# Altium schematic sheet CAN.SchDoc
size 420 x 297 mm; SheetNumber: 3; SheetTotal: 3
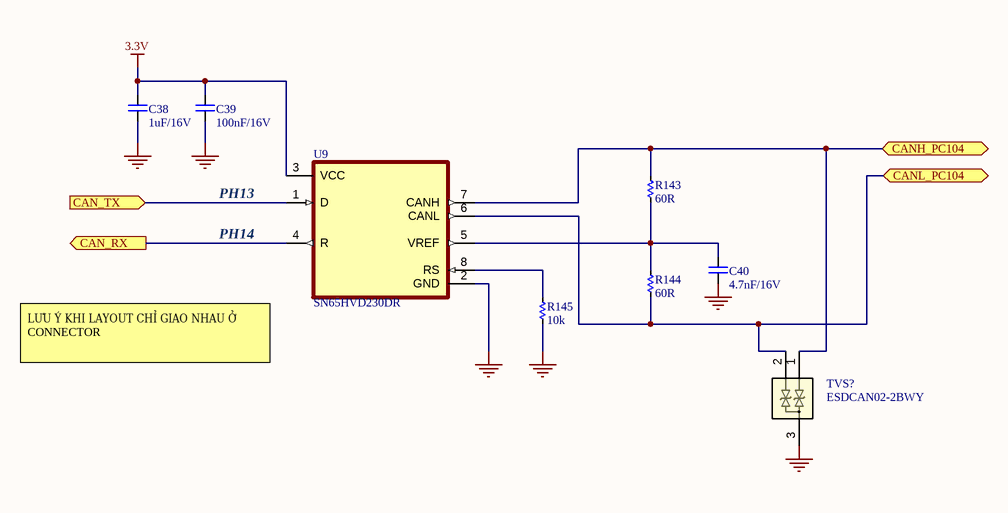
[diagram p0: CAN.SchDoc]

## Parts
C38  1uF/16V  [CAP_C_1608X80]
C39  100nF/16V  [CAP_C_1608X80]
C40  4.7nF/16V  [CAP_C_1608X80]
R143  60R  [RES_C_1608X60]
R144  60R  [RES_C_1608X60]
R145  10k  [RES_C_1608X60]
TVS?  ESDCAN02-2BWY  [SOT323-3L_STM]
U9  SN65HVD230DR  [SOIC127P599X175-8N]

## Ports
CAN_RX (out), CAN_TX (in), CANH_PC104 (bidir), CANL_PC104 (bidir)

## Nets
3.3V: C38.1 C39.1 U9.3(VCC)
GND: C38.2 C39.2 C40.2 R145.1 TVS?.3 U9.2(GND)
CAN_RX: U9.4(R) ; port CAN_RX
CAN_TX: U9.1(D) ; port CAN_TX
CANH_PC104: R143.2 TVS?.1 U9.7(CANH) ; port CANH_PC104
CANL_PC104: R144.1 TVS?.2 U9.6(CANL) ; port CANL_PC104
NetC40_1: C40.1 R143.1 R144.2 U9.5(VREF)
NetR145_2: R145.2 U9.8(RS)

## Notes on the sheet
- PH13
- PH14
- (near U9) LƯU Ý KHI LAYOUT CHỈ GIAO NHAU Ở CONNECTOR
- Sub-system:
- Design by:
- Sheet title:
- Project:
- Sheet:
- of
- Checked by:
- Approved by:
- Doc no:
- Revision:
- Size:
- Date:

## Library data of the parts
C38-C40 = CAP_SMD: CAP_Chip; Value: 33pF
R143-R145 = _RES_B_2: RES
TVS? = ESDCAN02-2BWY: Automotive dual-line TVS in SOT323-3L for CAN bus (12 V system); Manufacturer_Name: STMicroelectronics; Copyright: Copyright (C) 2025 Ultra Librarian. All rights reserved.; Manufacturer_Part_Number: ESDCAN02-2BWY; RefDes: RefDes; Type: Type
U9 = SN65HVD230DR: 3.3 V CAN Transceiver with Standby Mode; MF: Texas Instruments; SnapEDA_Link: https://www.snapeda.com/parts/SN65HVD230DR/Texas+Instruments/view-part/?ref=snap; Package: SOIC-8 Texas Instruments; Value: *; MP: SN65HVD230DR; Check_prices: https://www.snapeda.com/parts/SN65HVD230DR/Texas+Instruments/view-part/?ref=eda